# EasyEDA Pro project ProPrj_ESP32精英板_2025-06-25.epro

# Schematic Schematic1

## Sheets
1 Core: Board Name: Board1; Create Date: 2023-09-26; Page Name: Core; Project Name: ESP32精英板; Schematic Name: Schematic1; Update Date: 2025-05-17; Company: 嘉立创EDA; Page Size: A4; Version: V1.0
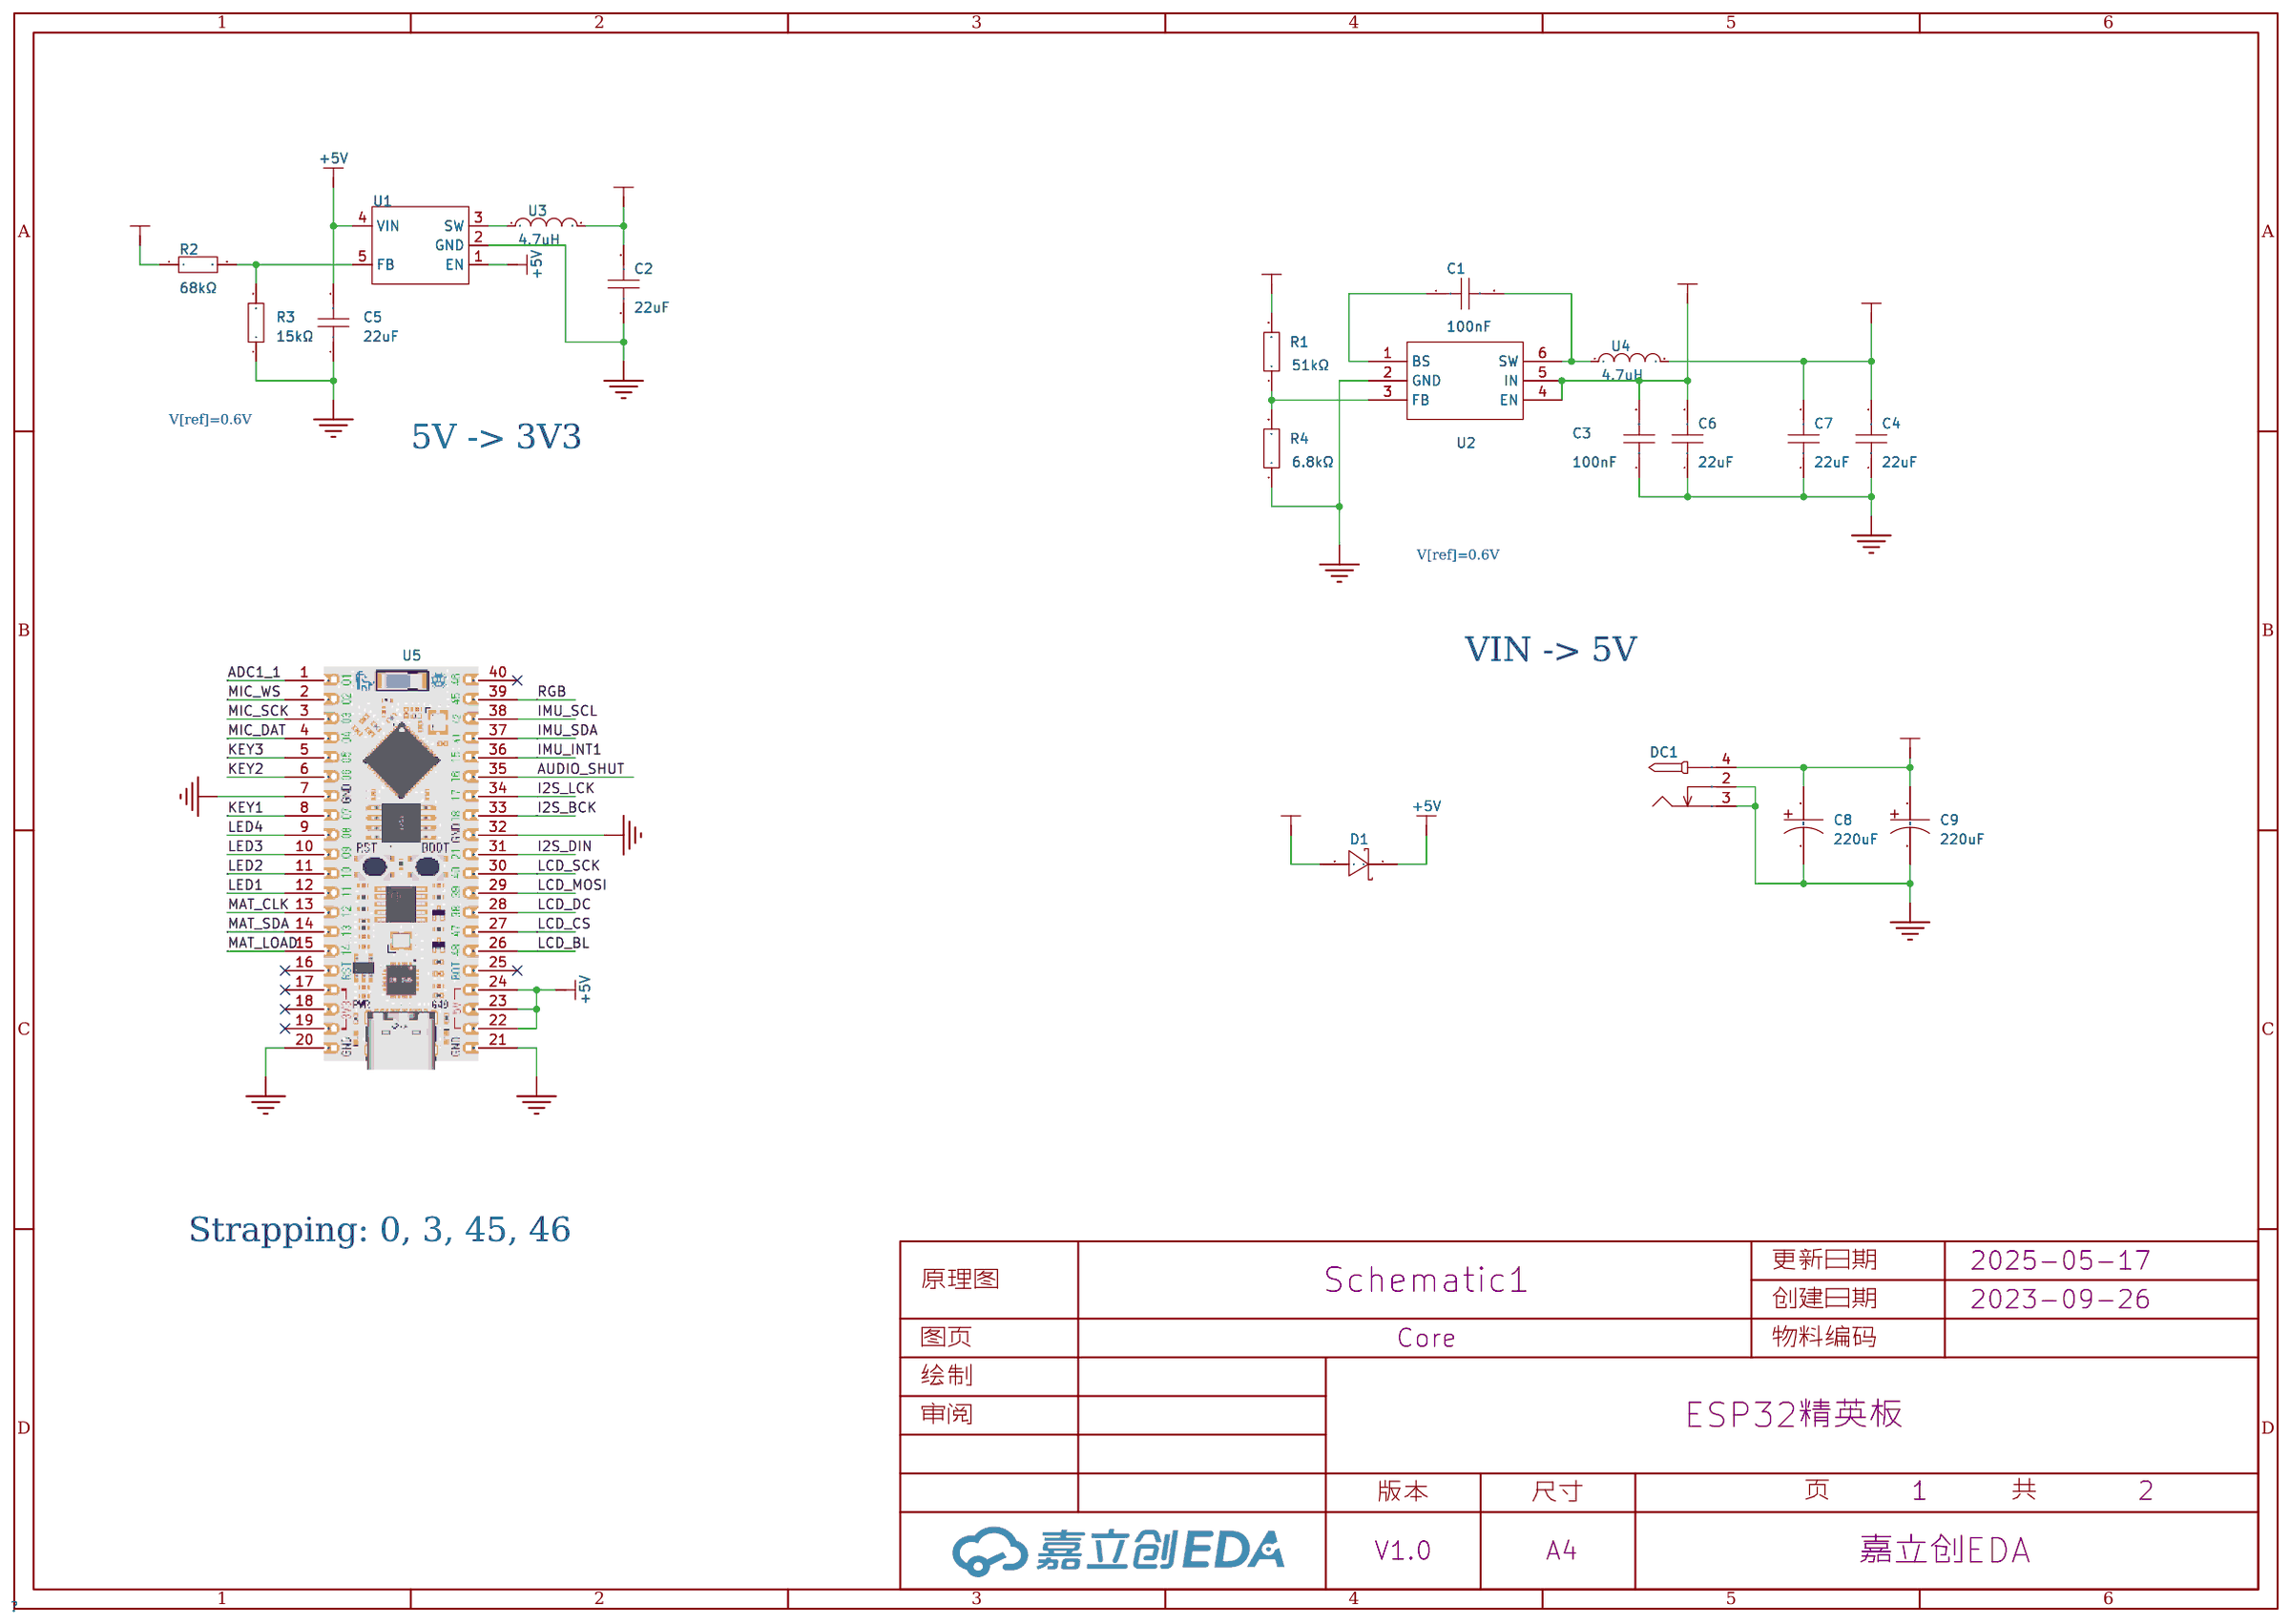
[diagram p0: Core]
2 Peripheral: Page Name: Peripheral; Update Date: 2025-05-12
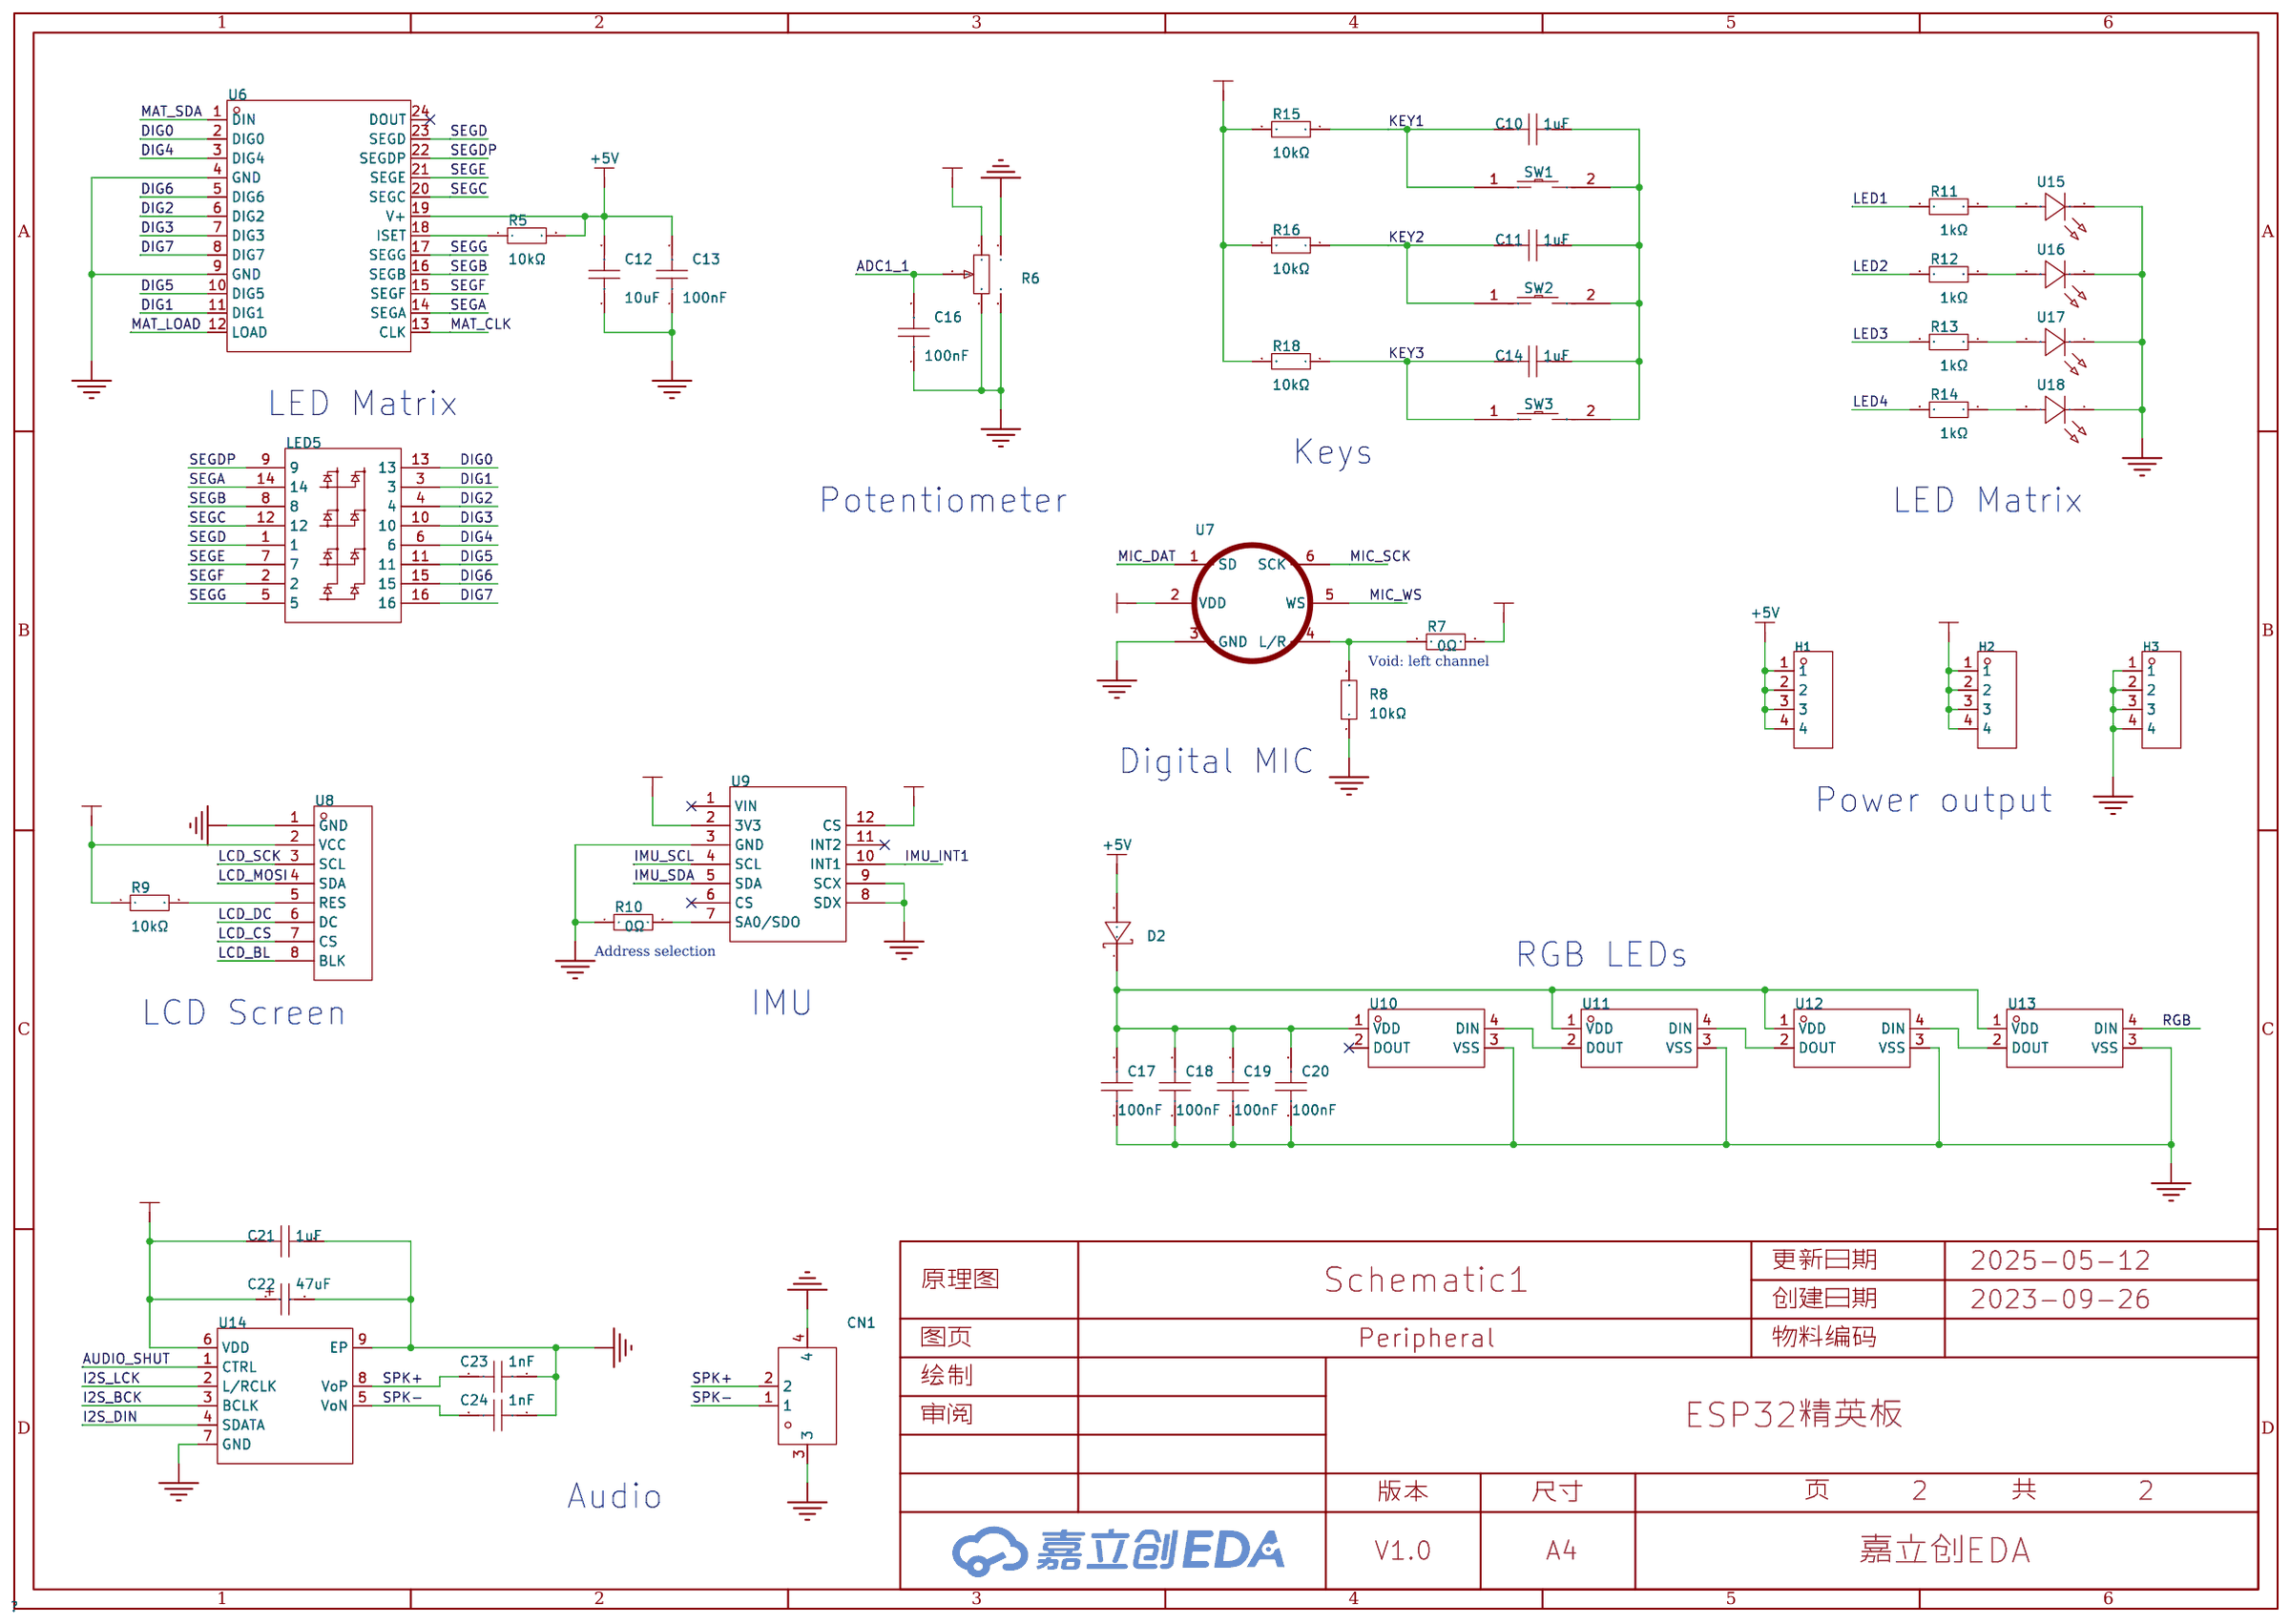
[diagram p1: Peripheral]

## Parts
sheet Core
C1  100nF  [c1206-nsk]
C2  22uF  [c1206-nsk]
C3  100nF  [c1206-nsk]
C4  22uF  [c1206-nsk]
C5  22uF  [c1206-nsk]
C6  22uF  [c1206-nsk]
C7  22uF  [c1206-nsk]
C8  220uF  [CAP-SMD_BD8.0-L8.3-W8.3-FD]
C9  220uF  [CAP-SMD_BD8.0-L8.3-W8.3-FD]
D1  SS34  [SMA_L4.3-W2.6-LS5.2-RD]
DC1  -  [DC-2.0]
R1  51kΩ  [R1206-NSK]
R2  68kΩ  [R1206-NSK]
R3  15kΩ  [R1206-NSK]
R4  6.8kΩ  [R1206-NSK]
U1  MT3520B  [SOT-23-5_L3.0-W1.7-P0.95-LS2.8-BR]
U2  MT2492  [SOT-23-6_L2.9-W1.6-P0.95-LS2.8-BL]
U3  4.7uH  [IND-SMD_L4.4-W4.2]
U4  4.7uH  [IND-SMD_L4.4-W4.2]
U5  LCKFB-ESP32S3R8N8  [DIP-40_L20.32-W51.66-P2.54-LS15.24]
sheet Peripheral
C10  1uF  [c1206-nsk]
C11  1uF  [c1206-nsk]
C12  10uF  [c1206-nsk]
C13  100nF  [c1206-nsk]
C14  1uF  [c1206-nsk]
C16  100nF  [c1206-nsk]
C17  100nF  [c1206-nsk]
C18  100nF  [c1206-nsk]
C19  100nF  [c1206-nsk]
C20  100nF  [c1206-nsk]
C21  1uF  [c1206-nsk]
C22  47uF  [CAP-SMD_L3.2-W1.6-RD]
C23  1nF  [c1206-nsk]
C24  1nF  [c1206-nsk]
CN1  HC-1.25-2PWT  [CONN-SMD_2P-P1.25-HC-1.25-2PWT]
D2  SS14  [SMA_L4.2-W2.6-LS5.3-RD]
H1  -  [HDR-TH_4P-P2.54-V-M]
H2  -  [HDR-TH_4P-P2.54-V-M]
H3  -  [HDR-TH_4P-P2.54-V-M]
LED5  SLD1388DRA1GD  [LED-TH_SLD1388DRA1GD]
R5  10kΩ  [R1206-NSK]
R6  RV09AF-40-15K-B10K-0C  [RES-ADJ-TH_RV09]
R7  0Ω  [R1206-NSK]
R8  10kΩ  [R1206-NSK]
R9  10kΩ  [R1206-NSK]
R10  0Ω  [R1206-NSK]
R11  1kΩ  [R1206-NSK]
R12  1kΩ  [R1206-NSK]
R13  1kΩ  [R1206-NSK]
R14  1kΩ  [R1206-NSK]
R15  10kΩ  [R1206-NSK]
R16  10kΩ  [R1206-NSK]
R18  10kΩ  [R1206-NSK]
SW1  GT-TC057A-H043-L1  [SW-SMD_L6.0-W3.5-LS8.2]
SW2  GT-TC057A-H043-L1  [SW-SMD_L6.0-W3.5-LS8.2]
SW3  GT-TC057A-H043-L1  [SW-SMD_L6.0-W3.5-LS8.2]
U6  HT7219ARWZ  [SOIC-24_L15.4-W7.5-P1.27-LS10.3-TL]
U7  -  [INMP441_6P]
U8  TFT模块接口  [HDR-TH_8P-P2.54-V-M]
U9  -  [GY-LSM6DS3]
U10  WS2812B  [LED-SMD_4P-L5.0-W5.0-TL]
U11  WS2812B  [LED-SMD_4P-L5.0-W5.0-TL]
U12  WS2812B  [LED-SMD_4P-L5.0-W5.0-TL]
U13  WS2812B  [LED-SMD_4P-L5.0-W5.0-TL]
U14  NS4168  [ESOP-8_L4.9-W3.9-P1.27-LS6.0-BL-EP-1]
U15  LED1206  [LED1206-RD]
U16  LED1206  [LED1206-RD]
U17  LED1206  [LED1206-RD]
U18  LED1206  [LED1206-RD]

## Library data of the parts
C1 C3 C13 C16-C20 = CL31B104KBCNNNC: 容值:100nF;精度:±10%;额定电压:50V;材质(温度系数):X7R;; LCSC Part Name: 100nF ±10% 50V; Supplier Part: C24497; Manufacturer: SAMSUNG(三星); Supplier Footprint: 1206; JLCPCB Part Class: Basic Part; Datasheet: https://atta.szlcsc.com/upload/public/pdf/source/20160218/1457707763339.pdf; Supplier: LCSC; Tolerance: ±10%; Voltage Rated: 50V; Temperature Coefficient: X7R
C2 C4-C7 = HGC1206R5226M250NSPJ: 容值:22uF;精度:±20%;额定电压:25V;温度系数:X5R;; LCSC Part Name: 22uF ±20% 25V; Supplier Part: C7432786; Manufacturer: Chinocera(华瓷); Supplier Footprint: 1206; JLCPCB Part Class: Extended Part; Datasheet: https://atta.szlcsc.com/upload/public/pdf/source/20240320/FAC3FEC40A78BC5CCCE96C232A94D860.pdf; Supplier: LCSC; Tolerance: ±20%; Voltage Rating: 25V; Temperature Coefficient: X5R
C8 C9 = VT1E221M0810: 容值:220uF;精度:±20%;额定电压:25V;纹波电流:183mA@120Hz;等效串联电阻(ESR):-;; LCSC Part Name: 220uF ±20% 25V; Supplier Part: C191825; Manufacturer: ROQANG(容强); Supplier Footprint: SMD,D8xL10.2mm; Datasheet: https://atta.szlcsc.com/upload/public/pdf/source/20180502/C191859_5B846418F1FC4C14CCCE0409874E2ED6.pdf; Supplier: LCSC; Tolerance: ±20%; Voltage Rating: 25V; Ripple Current: 183mA@120Hz; Diameter: 8mm; Height - Seated (Max): 10.2mm; Lifetime: 2000hrs@105℃; Operating Temperature: -40℃~+105℃
D1 = SS34_C8678: 二极管配置:独立式;直流反向耐压(Vr):40V;平均整流电流(Io):3A;正向压降(Vf):550mV@3A;; LCSC Part Name: 40V 3A 550mV@3A; Supplier Part: C8678; Manufacturer: MDD; Supplier Footprint: SMA(DO-214AC); JLCPCB Part Class: 基础库; Datasheet: https://atta.szlcsc.com/upload/public/pdf/source/20230314/A80AE34493C69B89E2F4B1712F433538.pdf; Supplier: LCSC; Diode Configuration: 独立式; Reverse Voltage (Vr): 40V; Average Rectified Current (Io): 3A; Forward Voltage (Vf@If): 550mV@3A; Reverse Leakage Current (Ir): 500uA@40V
DC1 = DC-005_2.0: Supplier Footprint: 插件; Check: false
R1 = 1206W4F5102T5E: 电阻类型:厚膜电阻;阻值:51kΩ;精度:±1%;功率:250mW;最大工作电压:200V;温度系数:±100ppm/℃;; LCSC Part Name: 51kΩ ±1% 250mW 厚膜电阻; Supplier Part: C17992; Manufacturer: UNI-ROYAL(厚声); Supplier Footprint: 1206; JLCPCB Part Class: Extended Part; Datasheet: https://atta.szlcsc.com/upload/public/pdf/source/20200306/C422600_1E6D84923E4A46A82E41ADD87F860B5C.pdf; Supplier: LCSC; Type: 厚膜电阻; Tolerance: ±1%; Power(Watts): 250mW; Overload Voltage (Max): 200V; Temperature Coefficient: ±100ppm/℃; Operating Temperature Range: -55℃~+155℃
R2 = 1206W4F6802T5E: 电阻类型:厚膜电阻;阻值:68kΩ;精度:±1%;功率:250mW;最大工作电压:200V;温度系数:±100ppm/℃;; LCSC Part Name: 68kΩ ±1% 250mW 厚膜电阻; Supplier Part: C25834; Manufacturer: UNI-ROYAL(厚声); Supplier Footprint: 1206; JLCPCB Part Class: Extended Part; Datasheet: https://atta.szlcsc.com/upload/public/pdf/source/20200306/C422600_1E6D84923E4A46A82E41ADD87F860B5C.pdf; Supplier: LCSC; Type: 厚膜电阻; Tolerance: ±1%; Power(Watts): 250mW; Overload Voltage (Max): 200V; Temperature Coefficient: ±100ppm/℃; Operating Temperature Range: -55℃~+155℃
R3 = RS-06K153JT: 电阻类型:厚膜电阻;阻值:15kΩ;精度:±5%;功率:250mW;最大工作电压:200V;温度系数:±100ppm/℃;; LCSC Part Name: 15kΩ ±5% 250mW; Supplier Part: C286642; Manufacturer: FH(风华); Supplier Footprint: 1206; JLCPCB Part Class: Extended Part; Datasheet: https://atta.szlcsc.com/upload/public/pdf/source/20140616/1457707091974.pdf; Supplier: LCSC; Type: 厚膜电阻; Tolerance: ±5%; Power(Watts): 250mW; Overload Voltage (Max): 200V; Temperature Coefficient: ±100ppm/℃; Operating Temperature Range: -55℃~+155℃
R4 = 1206W4F6801T5E: 电阻类型:厚膜电阻;阻值:6.8kΩ;精度:±1%;功率:250mW;最大工作电压:200V;温度系数:±100ppm/℃;; LCSC Part Name: 6.8kΩ ±1% 250mW 厚膜电阻; Supplier Part: C26034; Manufacturer: UNI-ROYAL(厚声); Supplier Footprint: 1206; JLCPCB Part Class: Extended Part; Datasheet: https://atta.szlcsc.com/upload/public/pdf/source/20200306/C422600_1E6D84923E4A46A82E41ADD87F860B5C.pdf; Supplier: LCSC; Type: 厚膜电阻; Tolerance: ±1%; Power(Watts): 250mW; Overload Voltage (Max): 200V; Temperature Coefficient: ±100ppm/℃; Operating Temperature Range: -55℃~+155℃
U1 = MT3520B: 功能类型:降压型;工作电压:2.3V~6V;输出电流:2A;; LCSC Part Name: 停产 MT3520B; Supplier Part: C2684933; Manufacturer: 西安航天民芯; Supplier Footprint: SOT-23-5; JLCPCB Part Class: 扩展库; Datasheet: https://atta.szlcsc.com/upload/public/pdf/source/20210114/C2684933_96E48358A8EFBD651AA46655486A36EF.pdf; Supplier: LCSC; Function: 降压型; Voltage - Supply: 2.3V~6V; Output Current: 2A; Frequency - Switching: 1.5MHz; Operating Temperature: -40℃~+85℃; Synchronous Rectifier: 是; Number of Outputs: 1; Switch tube (built-in/external): 内置
U2 = MT2492: 功能类型:降压型;同步整流:-;输出通道数:-;拓扑结构:-;输入电压:-;输出电流(最大值):-;开关频率:-;; LCSC Part Name: 降压型; Supplier Part: C89358; Manufacturer: 西安航天民芯; Supplier Footprint: SOT-23-6; JLCPCB Part Class: 扩展库; Datasheet: https://atta.szlcsc.com/upload/public/pdf/source/20221209/5C81DA9662873D3A116170FFBF63E49D.pdf; Supplier: LCSC; Function: 降压型
U3 U4 = APH0420T4R7M: 电感值:4.7uH;精度:±20%;额定电流:2.29A;饱和电流(Isat):2.49A;类型:一体成型电感;; LCSC Part Name: 4.7uH ±20% 2.49A; Supplier Part: C5349668; Manufacturer: APV(爱普微); Supplier Footprint: SMD,4.4x4.2mm; JLCPCB Part Class: 扩展库; Datasheet: https://atta.szlcsc.com/upload/public/pdf/source/20240422/44C6AF90C0CE08E50D7C2708B16BB974.pdf; Supplier: LCSC; Tolerance: ±20%; Rated Current: 2.29A; Saturation Current (Isat): 2.49A; DC Resistance (DCR): 105mΩ; Type: 一体成型电感
U5 = LCKFB-ESP32S3R8N8: LCSC Part Name: 立创·ESP32S3R8N8 开发板; Supplier Part: C20626143; Manufacturer: 立创开发板; JLCPCB Part Class: Extended Part; Datasheet: https://atta.szlcsc.com/upload/public/pdf/source/20241206/8BAF30E9665AF2DA28B66306BACEE9A0.pdf; Supplier: LCSC
C10 C11 C14 C21 = CL31B105KBHNNNE: 容值:1uF;精度:±10%;额定电压:50V;材质(温度系数):X7R;; LCSC Part Name: 1uF ±10% 50V; Supplier Part: C1848; Manufacturer: SAMSUNG(三星); Supplier Footprint: 1206; JLCPCB Part Class: Basic Part; Datasheet: https://atta.szlcsc.com/upload/public/pdf/source/20160218/1457707763339.pdf; Supplier: LCSC; Tolerance: ±10%; Voltage Rated: 50V; Temperature Coefficient: X7R
C12 = HGC1206R5106K500NSPJ: 容值:10uF;精度:±10%;额定电压:50V;温度系数:X5R;; LCSC Part Name: 10uF ±10% 50V; Supplier Part: C7432781; Manufacturer: Chinocera(华瓷); Supplier Footprint: 1206; JLCPCB Part Class: Extended Part; Datasheet: https://atta.szlcsc.com/upload/public/pdf/source/20240320/FAC3FEC40A78BC5CCCE96C232A94D860.pdf; Supplier: LCSC; Tolerance: ±10%; Voltage Rating: 50V; Temperature Coefficient: X5R
C22 = TAJA476K006RNJ: 容值:47uF;精度:±10%;额定电压:6.3V;等效串联电阻:1.6Ω@100kHz;; LCSC Part Name: 47uF ±10% 6.3V; Supplier Part: C7190; Manufacturer: Kyocera AVX; Supplier Footprint: CASE-A-3216; JLCPCB Part Class: Extended Part; Datasheet: https://atta.szlcsc.com/upload/public/pdf/source/20160107/1457707748639.pdf; Supplier: LCSC; Tolerance: ±10%; Rated Voltage: 6.3V; Equivalent Series Resistance(ESR): 1.6Ω@100kHz; Operating Temperature: -55℃~+125℃
C23 C24 = 1206B102K202NT: 容值:1nF;精度:±10%;额定电压:2kV;温度系数:X7R;; LCSC Part Name: 1nF ±10% 2kV; Supplier Part: C9196; Manufacturer: FH(风华); Supplier Footprint: 1206; JLCPCB Part Class: Basic Part; Datasheet: https://atta.szlcsc.com/upload/public/pdf/source/20200305/C486355_26A10D38EF8C2A5C37091D0039909270.pdf; Supplier: LCSC; Tolerance: ±10%; Voltage Rating: 2kV; Temperature Coefficient: X7R
CN1 = HC-1.25-2PWT: 插针结构:1x2P;间距:1.25mm;安装方式:卧贴;参考系列:PicoBlade(MX 1.25);总PIN数:2P;排数:1;每排PIN数:2;行距:-;额定电流:1A;触头材质:黄铜;触头镀层:锡;工作温度范围:-40℃~+105℃;; LCSC Part Name: 1x2P 间距:1.25mm 卧贴 系列:PicoBlade(MX 1.25); Supplier Part: C2845379; Manufacturer: HCTL(华灿天禄); Supplier Footprint: SMD,P=1.25mm,卧贴; JLCPCB Part Class: 扩展库; Datasheet: https://atta.szlcsc.com/upload/public/pdf/source/20240930/9508A8292CCC87B0C29E3A028D56E30A.pdf; Supplier: LCSC; Pins Structure: 1x2P; Pitch: 1.25mm; Mounting Style: 卧贴; Reference Series: PicoBlade(MX 1.25); Number of Pins: 2P; Number of Rows: 1; Number of PINs Per Row: 2; Current Rating (Max): 1A; Contact Material: 黄铜; Contact Plating: 锡; Operating Temperature Range: -40℃~+105℃; Rated Voltage (Max): 125V; Plastic Material: LCP; Flame Retardant Rating: UL94V-0; Supplementary Features: 辅助焊脚; Z-Height of the Board: 3.57mm; X-Length of Bottom Edge on Board (Spacing Line): 7.55mm; Y-Width of Bottom Edge on Board: 5.25mm
D2 = SS14_C2480: 二极管配置:独立式;正向压降(Vf):550mV@1A;直流反向耐压(Vr):40V;整流电流:1A;; LCSC Part Name: 电压:40V 电流:1A; Supplier Part: C2480; Manufacturer: MDD(辰达半导体); Supplier Footprint: SMA(DO-214AC); JLCPCB Part Class: 基础库; Datasheet: https://atta.szlcsc.com/upload/public/pdf/source/20240710/EF24798823EE33D63F154ED67BAC5E71.pdf; Supplier: LCSC; Diode Configuration: 独立式; Forward Voltage (Vf@If): 550mV@1A; Reverse Voltage (Vr): 40V; Rectified Current: 1A; Reverse Leakage Current (Ir): 300uA@40V
H1-H3 = HDR-M_2.54_1x4P: Supplier Part: C492403; Supplier Footprint: 插件
LED5 = SLD1388DRA1GD_C2913075: 位数:8x8;发光颜色:红色;极性:共阳;; LCSC Part Name: 8*8mm,红光,共阳LED点阵数码管,插件; Supplier Part: C2913075; Manufacturer: SUNLIGHT(光华); Supplier Footprint: 插件; JLCPCB Part Class: 扩展库; Datasheet: https://atta.szlcsc.com/upload/public/pdf/source/20180608/C225991_CE8A1D71268437AD8DFF1F8467A765B7.pdf; Supplier: LCSC; Dot Matrix Number: 8x8; Emitting Color: 红色; Polarity: 共阳
R5 R8 R9 R15 R16 R18 = 1206W4F1002T5E: 电阻类型:厚膜电阻;阻值:10kΩ;精度:±1%;功率:250mW;最大工作电压:200V;温度系数:±100ppm/℃;; LCSC Part Name: 10kΩ ±1% 250mW 厚膜电阻; Supplier Part: C17902; Manufacturer: UNI-ROYAL(厚声); Supplier Footprint: 1206; JLCPCB Part Class: Basic Part; Datasheet: https://atta.szlcsc.com/upload/public/pdf/source/20200306/C422600_1E6D84923E4A46A82E41ADD87F860B5C.pdf; Supplier: LCSC; Type: 厚膜电阻; Tolerance: ±1%; Power(Watts): 250mW; Overload Voltage (Max): 200V; Temperature Coefficient: ±100ppm/℃; Operating Temperature Range: -55℃~+155℃
R6 = RV09AF-40-15K-B10K-0C: Supplier Part: C5151446; Supplier Footprint: 插件; JLCPCB Part Class: 扩展库; Supplier: LCSC
R7 R10 = 1206W4F0000T5E: 电阻类型:厚膜电阻;阻值:0Ω;精度:±1%;功率:250mW;最大工作电压:200V;温度系数:±800ppm/℃;; LCSC Part Name: 0Ω ±1% 250mW 厚膜电阻; Supplier Part: C17888; Manufacturer: UNI-ROYAL(厚声); Supplier Footprint: 1206; JLCPCB Part Class: Basic Part; Datasheet: https://atta.szlcsc.com/upload/public/pdf/source/20200306/C422600_1E6D84923E4A46A82E41ADD87F860B5C.pdf; Supplier: LCSC; Type: 厚膜电阻; Tolerance: ±1%; Power(Watts): 250mW; Overload Voltage (Max): 200V; Temperature Coefficient: ±800ppm/℃; Operating Temperature Range: -55℃~+155℃
R11-R14 = 1206W4F1001T5E_C4410: 电阻类型:厚膜电阻;阻值:1kΩ;精度:±1%;功率:250mW;最大工作电压:200V;; LCSC Part Name: 1kΩ ±1% 250mW 厚膜电阻; Supplier Part: C4410; Manufacturer: UNI-ROYAL(厚声); Manufacturer Part: 1206W4F1001T5E; Supplier Footprint: 1206; JLCPCB Part Class: Basic Part; Datasheet: https://atta.szlcsc.com/upload/public/pdf/source/20200306/C422600_1E6D84923E4A46A82E41ADD87F860B5C.pdf; Supplier: LCSC; Type: 厚膜电阻; Tolerance: ±1%; Power(Watts): 250mW; Overload Voltage (Max): 200V; Operating Temperature Range: -55℃~+155℃
SW1-SW3 = GT-TC057A-H043-L1: 触点电流:50mA;额定电压(DC):12V;绝缘电阻:100MΩ;电路结构:单刀单掷;安装方式:立贴;带灯:无;作用力:160gf@±30gf;机械寿命:10万次;带支架:否;; LCSC Part Name: 6*3.5*4.3mm 立贴 轻触开关; Supplier Part: C843677; Manufacturer: G-Switch(品赞); Supplier Footprint: SMD; JLCPCB Part Class: Extended Part; Datasheet: https://atta.szlcsc.com/upload/public/pdf/source/20201110/C843677_DEB4979EF332B8E57B4292C014A2ED6A.pdf; Supplier: LCSC; Contact Current: 50mA; Voltage Rating (DC): 12V; Insulation Resistance: 100MΩ; Circuit: 单刀单掷; Mounting Style: 立贴; Actuator Style: 矩形按钮; Actuator/Cap Color: 黑色; With Lamp: 无; Operating Force: 160gf@±30gf; Mechanical Life: 10万次; Operating Temperature: -30℃~+85℃; Pin Style: 鸥翼型; Switch Length: 6mm; Switch Width: 3.5mm; Switch Height: 4.3mm; Strike Gundam: 否
U6 = HT7219ARWZ: 串行接口， 8位LED显示驱动器; Supplier Part: C2834487; Manufacturer: HTCSEMI(海天芯); Supplier Footprint: SOP-24; JLCPCB Part Class: 扩展库; Datasheet: https://atta.szlcsc.com/upload/public/pdf/source/20210730/C2834487_B6FE5CAFBF35974579B95809D10FECA5.pdf; Supplier: LCSC
U7 = INMP441: INMP441是一款高性能，低功耗，数字输出，带底部端口的全向MEMS麦克风; Check: false
U8 = TFT模块接口: Check: false
U9 = GY-LSM6DS3: Check: false
U10-U13 = WS2812B_C9900004137: Supplier Part: C9900004137; Supplier Footprint: LED-4_5050; JLCPCB Part Class: 扩展库; Supplier: LCSC
U14 = NS4168: Supplier Part: C9900042517; Supplier Footprint: ESOP-8; Supplier: LCSC
U15-U18 = LED1206: Supplier Part: C9900027223; JLCPCB Part Class: 扩展库; Supplier: LCSC

## Nets
3V3: C2.2 C21.1 C22.1 H2.1 H2.2 H2.3 H2.4 R2.1 R6.1 R7.2 R9.1 R15.2 R16.2 R18.2 U3.2 U7.2(VDD) U8.2(VCC) U9.2(3V3) U9.12(CS) U14.6(VDD)
+5V: C5.2 C12.2 C13.2 D1.1(K) D2.2(A) H1.1 H1.2 H1.3 H1.4 R5.2 U1.1(EN) U1.4(VIN) U5.22(3V3) U5.23(3V3) U5.24(3V3) U6.19(V+)
+5V_BUCK: C4.2 C7.2 D1.2(A) R1.2 U4.2
GND: C2.1 C3.1 C4.1 C5.1 C6.1 C7.1 C8.2 C9.2 C10.1 C11.1 C12.1 C13.1 C14.1 C16.1 C17.1 C18.1 C19.1 C20.1 C21.2 C22.2 C23.1 C24.1 CN1.3 CN1.4 DC1.2 DC1.3 H3.1 H3.2 H3.3 H3.4 R3.1 R4.1 R6.3 R6.4 R6.5 R8.1 R10.1 SW1.2 SW2.2 SW3.2 U1.2(GND) U2.2(GND) U5.7(GND) U5.20(GND) U5.21(GND) U5.32(G08) U6.4(GND) U6.9(GND) U7.3(GND) U8.1(GND) U9.3(GND) U9.8(SDX) U9.9(SCX) U10.3(VSS) U11.3(VSS) U12.3(VSS) U13.3(VSS) U14.7(GND) U14.9(EP) U15.1(K) U16.1(K) U17.1(K) U18.1(K)
VIN: C3.2 C6.2 C8.1 C9.1 DC1.4 U2.4(EN) U2.5(IN)
ADC1_1: C16.2 R6.2 U5.1(G01)
AUDIO_SHUT: U5.35(G06) U14.1(CTRL)
DIG0: LED5.13 U6.2(DIG0)
DIG1: LED5.3 U6.11(DIG1)
DIG2: LED5.4 U6.6(DIG2)
DIG3: LED5.10 U6.7(DIG3)
DIG4: LED5.6 U6.3(DIG4)
DIG5: LED5.11 U6.10(DIG5)
DIG6: LED5.15 U6.5(DIG6)
DIG7: LED5.16 U6.8(DIG7)
I2S_BCK: U5.33(G07) U14.3(BCLK)
I2S_DIN: U5.31(G09) U14.4(SDATA)
I2S_LCK: U5.34(GND) U14.2(L/RCLK)
IMU_INT1: U5.36(G05) U9.10(INT1)
IMU_SCL: U5.38(G03) U9.4(SCL)
IMU_SDA: U5.37(G04) U9.5(SDA)
KEY1: C10.2 R15.1 SW1.1 U5.8(G07)
KEY2: C11.2 R16.1 SW2.1 U5.6(G06)
KEY3: C14.2 R18.1 SW3.1 U5.5(G05)
LCD_BL: U5.26(G14) U8.8(BLK)
LCD_CS: U5.27(G13) U8.7(CS)
LCD_DC: U5.28(G12) U8.6(DC)
LCD_MOSI: U5.29(G11) U8.4(SDA)
LCD_SCK: U5.30(G10) U8.3(SCL)
LED1: R11.2 U5.12(G11)
LED2: R12.2 U5.11(G10)
LED3: R13.2 U5.10(G09)
LED4: R14.2 U5.9(G08)
MAT_CLK: U5.13(G12) U6.13(CLK)
MAT_LOAD: U5.15(G14) U6.12(LOAD)
MAT_SDA: U5.14(G13) U6.1(DIN)
MIC_DAT: U5.4(G04) U7.1(SD)
MIC_SCK: U5.3(G03) U7.6(SCK)
MIC_WS: U5.2(G02) U7.5(WS)
RGB: U5.39(G02) U13.4(DIN)
SEGA: LED5.14 U6.14(SEGA)
SEGB: LED5.8 U6.16(SEGB)
SEGC: LED5.12 U6.20(SEGC)
SEGD: LED5.1 U6.23(SEGD)
SEGDP: LED5.9 U6.22(SEGDP)
SEGE: LED5.7 U6.21(SEGE)
SEGF: LED5.2 U6.15(SEGF)
SEGG: LED5.5 U6.17(SEGG)
SPK+: C23.2 CN1.2 U14.8(VoP)
SPK-: C24.2 CN1.1 U14.5(VoN)
$1N3653: C1.2 U2.6(SW) U4.1
$1N3654: C1.1 U2.1(BS)
$1N3655: R1.1 R4.2 U2.3(FB)
$1N9647: R2.2 R3.2 U1.5(FB)
$1N9651: U1.3(SW) U3.1
$2N2035: U12.4(DIN) U13.2(DOUT)
$2N2040: U10.4(DIN) U11.2(DOUT)
$2N2043: U11.4(DIN) U12.2(DOUT)
$2N2181: C17.2 C18.2 C19.2 C20.2 D2.1(K) U10.1(VDD) U11.1(VDD) U12.1(VDD) U13.1(VDD)
$2N3036: R11.1 U15.2(A)
$2N3041: R12.1 U16.2(A)
$2N3046: R13.1 U17.2(A)
$2N3051: R14.1 U18.2(A)
$2N4680: R5.1 U6.18(ISET)
$2N12609: R9.2 U8.5(RES)
$2N13495: R10.2 U9.7(SA0/SDO)
$2N13842: R7.1 R8.2 U7.4(L/R)

Not connected (* = marked no-connect by the designer): U5 16(RST)* 17(3V3)* 18(3V3)* 19(3V3)* 25(RST)* 40(G01)*; U6 24(DOUT)*; U9 1(VIN)* 6(CS)* 11(INT2)*; U10 2(DOUT)*

## Notes on the sheets
sheet 1
- V[ref]=0.6V
- 5V -> 3V3
- V[ref]=0.6V
- VIN -> 5V
- Strapping: 0, 3, 45, 46
sheet 2
- LED Matrix
- Keys
- Potentiometer
- LED Matrix
- Void: left channel
- Digital MIC
- Power output
- Address selection
- RGB LEDs
- LCD Screen
- IMU
- Audio

# Board PCB1
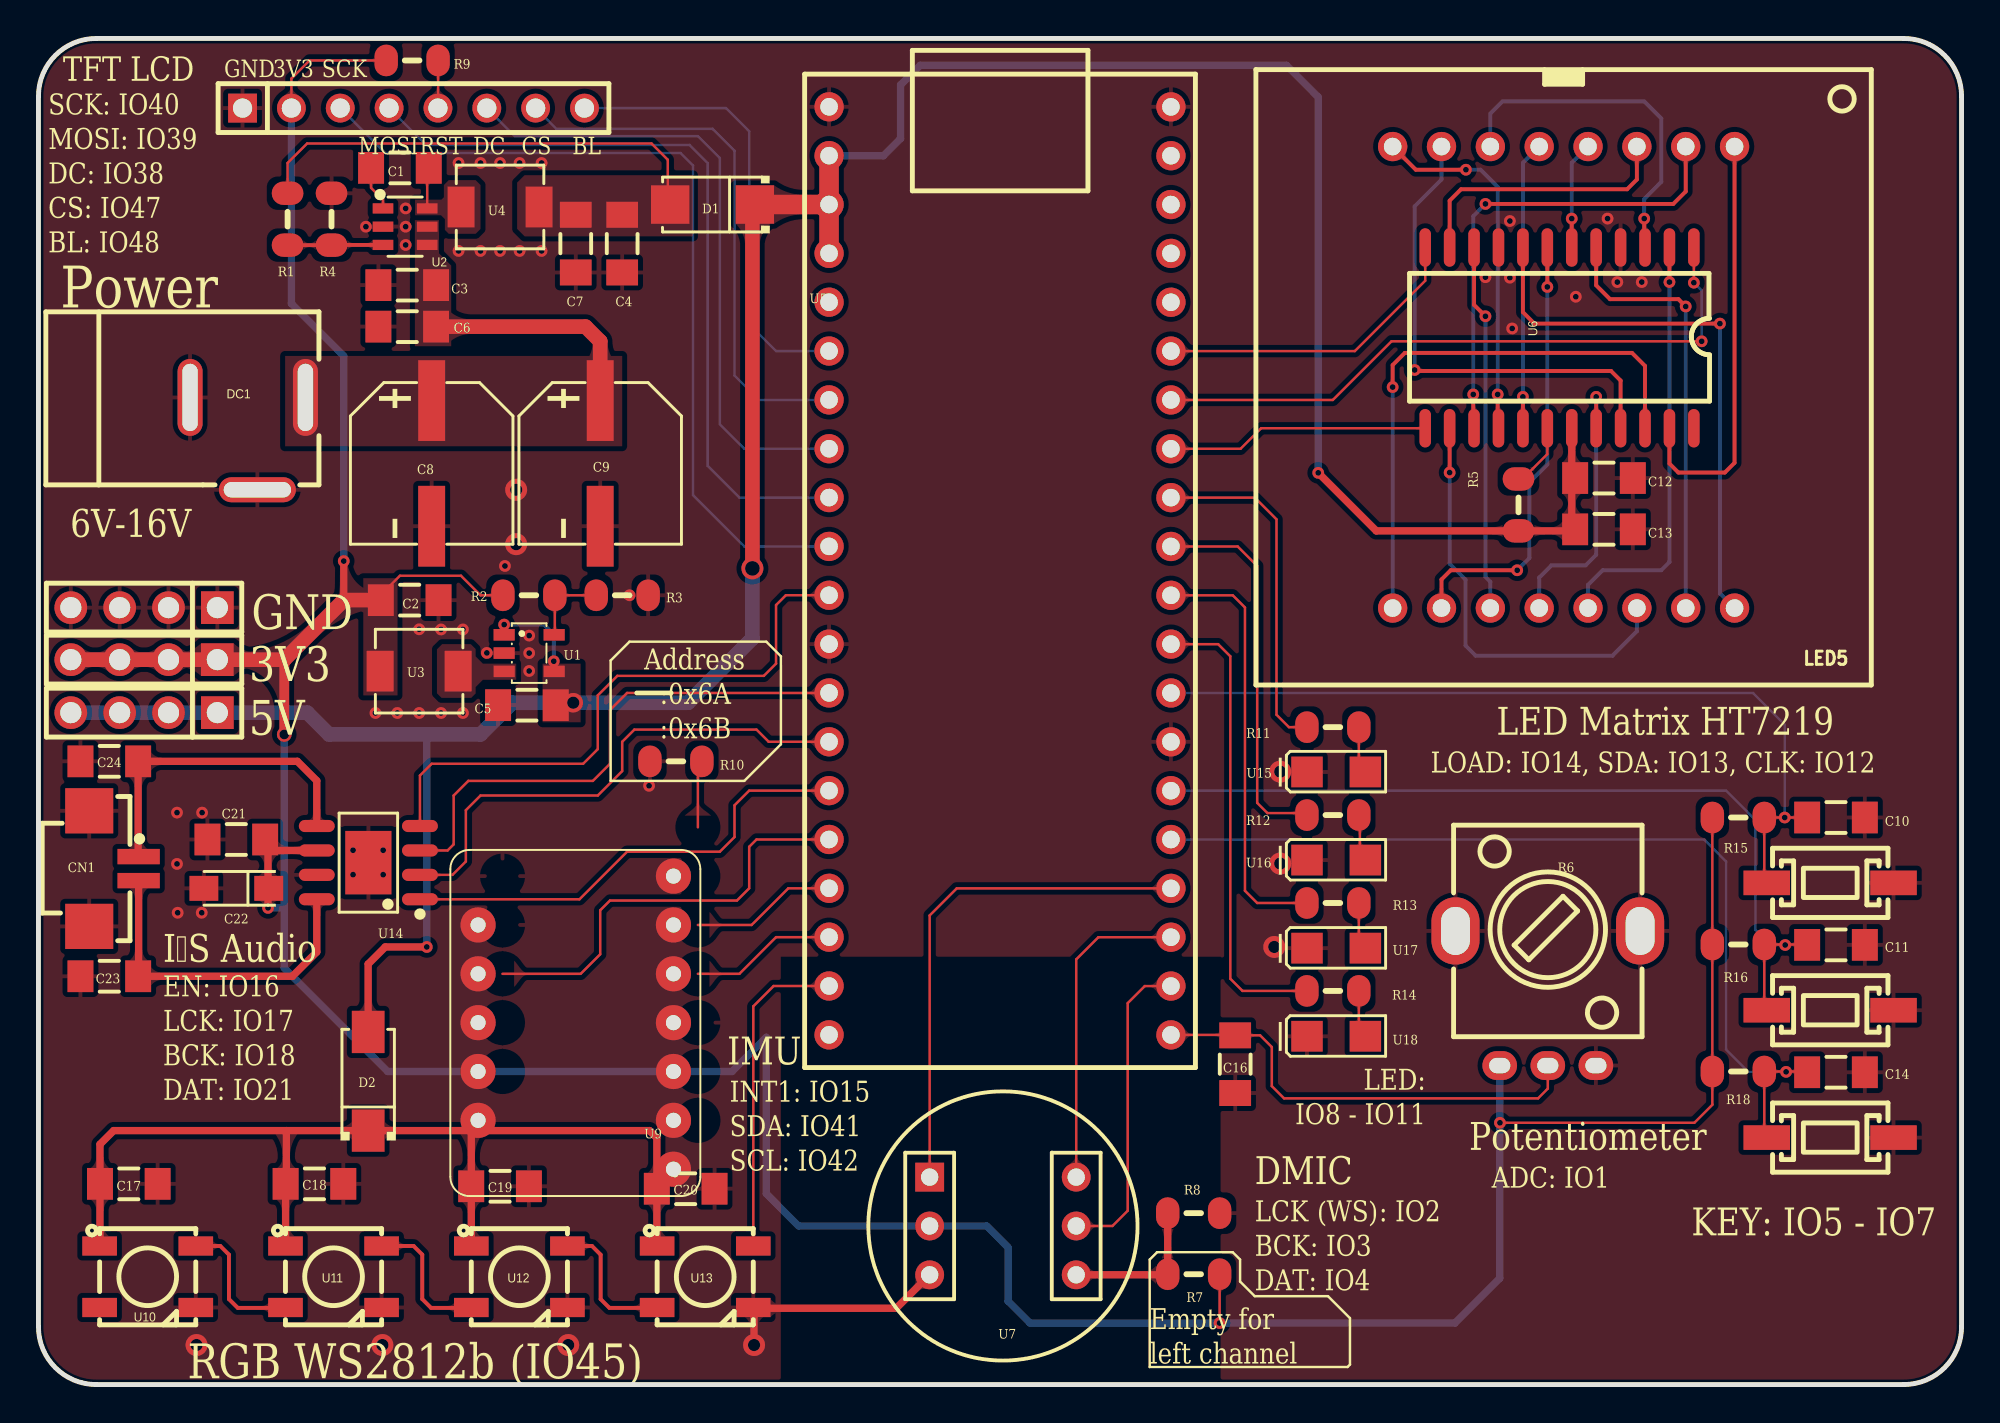
[diagram p2: board, top side]
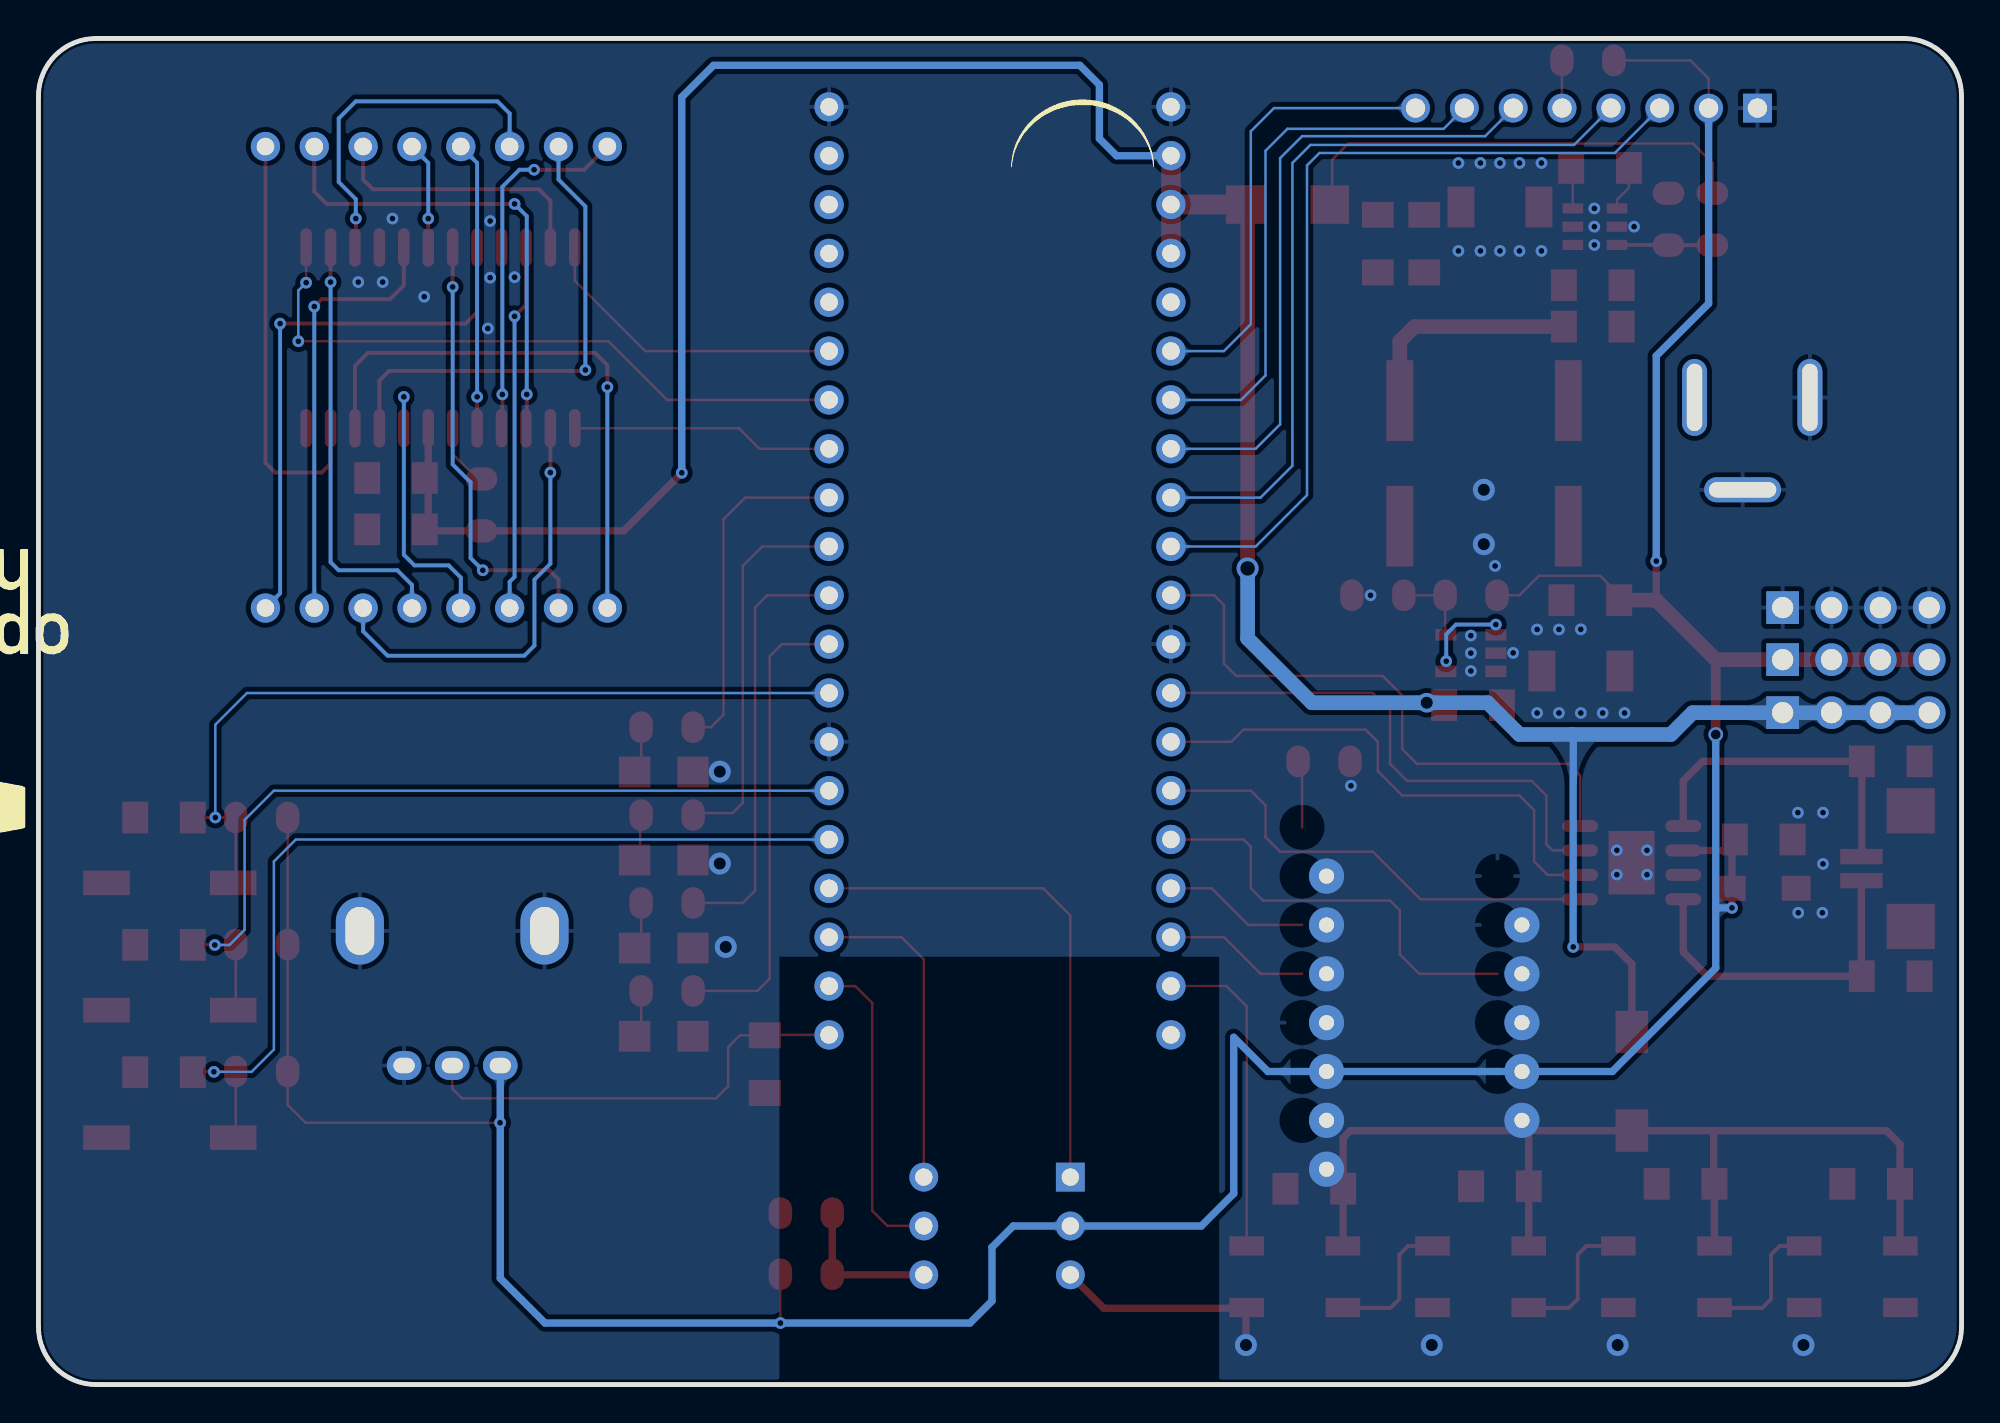
[diagram p3: board, bottom side, seen from below]

Outline 100 x 70 mm; copper layers: Top Layer, Bottom Layer. Coordinates in mm from the lower left corner of the outline.
Outline path: 0,67 0,3 arc(0.88,0.88) 3,0 97,0 arc(99.12,0.88) 100,3 100,67 arc(99.12,69.12) 97,70 3,70 arc(0.88,69.12) 0,67
Stack: Top Layer 0.035mm / Dielectric1 1.51mm FR4 er 4.5 / Bottom Layer 0.035mm

## Design rules (mm)
template: 自定义配置
spacing copperThickness1oz (default): track to track 0.102, other pairs 0.152 to 0.3
spacing copperThickness2oz: track to track 0.203, other pairs 0.152 to 0.3
track width copperThickness1oz (default): min 0.127, default 0.254, max 2.54
track width copperThickness2oz: min 0.203, default 0.254, max 2.54
differential pair differentialPair (default): width min 0.127, default 0.254, max 2.54; gap min 0.152, default 0.152
via viaSize (default): diameter min 0.5, default 0.61, max 10; hole min 0.3, default 0.305, max 6.3

## Placement (name value [footprint] x y rotation side)
C1  100nF  [c1206-nsk]  18.8 63.27 0 top
C2  22uF  [c1206-nsk]  19.3 40.79 180 top
C3  100nF  [c1206-nsk]  19.18 57.17 0 top
C4  22uF  [c1206-nsk]  30.35 59.33 90 top
C5  22uF  [c1206-nsk]  25.4 35.33 0 top
C6  22uF  [c1206-nsk]  19.18 55.01 0 top
C7  22uF  [c1206-nsk]  27.94 59.33 90 top
C8  220uF  [CAP-SMD_BD8.0-L8.3-W8.3-FD]  20.45 47.9 270 top
C9  220uF  [CAP-SMD_BD8.0-L8.3-W8.3-FD]  29.21 47.9 270 top
C10  1uF  [c1206-nsk]  93.47 29.49 180 top
C11  1uF  [c1206-nsk]  93.47 22.86 180 top
C12  10uF  [c1206-nsk]  81.41 47.14 180 top
C13  100nF  [c1206-nsk]  81.41 44.47 180 top
C14  1uF  [c1206-nsk]  93.47 16.24 180 top
C16  100nF  [c1206-nsk]  62.23 16.66 90 top
C17  100nF  [c1206-nsk]  4.7 10.44 180 top
C18  100nF  [c1206-nsk]  14.35 10.44 180 top
C19  100nF  [c1206-nsk]  24 10.31 180 top
C20  100nF  [c1206-nsk]  33.66 10.18 180 top
C21  1uF  [c1206-nsk]  10.29 28.34 180 top
C22  47uF  [CAP-SMD_L3.2-W1.6-RD]  10.29 25.8 180 top
C23  1nF  [c1206-nsk]  3.68 21.23 0 top
C24  1nF  [c1206-nsk]  3.68 32.41 0 top
CN1  HC-1.25-2PWT  [CONN-SMD_2P-P1.25-HC-1.25-2PWT]  3.92 26.83 270 top
D1  SS34  [SMA_L4.3-W2.6-LS5.2-RD]  35.05 61.36 180 top
D2  SS14  [SMA_L4.2-W2.6-LS5.3-RD]  17.14 15.77 90 top
DC1  -  [DC-2.0]  10.76 51.6 180 top
H1  -  [HDR-TH_4P-P2.54-V-M]  5.49 34.94 180 top
H2  -  [HDR-TH_4P-P2.54-V-M]  5.49 37.7 180 top
H3  -  [HDR-TH_4P-P2.54-V-M]  5.49 40.4 180 top
LED5  SLD1388DRA1GD  [LED-TH_SLD1388DRA1GD]  79.31 52.38 180 top
R1  51kΩ  [R1206-NSK]  12.95 60.6 90 top
R2  68kΩ  [R1206-NSK]  25.5 41.04 0 top
R3  15kΩ  [R1206-NSK]  30.35 41.04 180 top
R4  6.8kΩ  [R1206-NSK]  15.24 60.6 270 top
R5  10kΩ  [R1206-NSK]  76.96 45.74 270 top
R6  RV09AF-40-15K-B10K-0C  [RES-ADJ-TH_RV09]  78.49 20.09 0 top
R7  0Ω  [R1206-NSK]  60.07 5.74 0 top
R8  10kΩ  [R1206-NSK]  60.07 8.91 180 top
R9  10kΩ  [R1206-NSK]  19.43 68.86 0 top
R10  0Ω  [R1206-NSK]  33.15 32.41 0 top
R11  1kΩ  [R1206-NSK]  67.31 34.19 180 top
R12  1kΩ  [R1206-NSK]  67.31 29.61 180 top
R13  1kΩ  [R1206-NSK]  67.31 25.04 180 top
R14  1kΩ  [R1206-NSK]  67.31 20.47 180 top
R15  10kΩ  [R1206-NSK]  88.39 29.49 180 top
R16  10kΩ  [R1206-NSK]  88.39 22.88 180 top
R18  10kΩ  [R1206-NSK]  88.39 16.28 180 top
SW1  GT-TC057A-H043-L1  [SW-SMD_L6.0-W3.5-LS8.2]  93.17 26.09 0 top
SW2  GT-TC057A-H043-L1  [SW-SMD_L6.0-W3.5-LS8.2]  93.17 19.47 0 top
SW3  GT-TC057A-H043-L1  [SW-SMD_L6.0-W3.5-LS8.2]  93.17 12.84 0 top
U1  MT3520B  [SOT-23-5_L3.0-W1.7-P0.95-LS2.8-BR]  25.52 38.04 180 top
U2  MT2492  [SOT-23-6_L2.9-W1.6-P0.95-LS2.8-BL]  19.06 60.21 270 top
U3  4.7uH  [IND-SMD_L4.4-W4.2]  19.8 37.1 0 top
U4  4.7uH  [IND-SMD_L4.4-W4.2]  24 61.24 180 top
U5  LCKFB-ESP32S3R8N8  [DIP-40_L20.32-W51.66-P2.54-LS15.24]  50 42.31 180 top
U6  HT7219ARWZ  [SOIC-24_L15.4-W7.5-P1.27-LS10.3-TL]  79.1 54.43 270 top
U7  -  [INMP441_6P]  50.15 8.25 270 top
U8  TFT模块接口  [HDR-TH_8P-P2.54-V-M]  19.5 66.38 0 top
U9  -  [GY-LSM6DS3]  29.21 21.36 180 top
U10  WS2812B  [LED-SMD_4P-L5.0-W5.0-TL]  5.68 5.61 0 top
U11  WS2812B  [LED-SMD_4P-L5.0-W5.0-TL]  15.34 5.61 0 top
U12  WS2812B  [LED-SMD_4P-L5.0-W5.0-TL]  25.01 5.61 0 top
U13  WS2812B  [LED-SMD_4P-L5.0-W5.0-TL]  34.67 5.61 0 top
U14  NS4168  [ESOP-8_L4.9-W3.9-P1.27-LS6.0-BL-EP-1]  17.16 27.14 90 top
U15  LED1206  [LED1206-RD]  67.48 31.86 0 top
U16  LED1206  [LED1206-RD]  67.48 27.27 0 top
U17  LED1206  [LED1206-RD]  67.48 22.69 0 top
U18  LED1206  [LED1206-RD]  67.48 18.11 0 top

## Footprints (pads in the part's own frame, mm; a bottom-side part is the same pattern mirrored in y, then rotated)
c1206-nsk
  rect 1.35x1.65 smd: 1(-1.5,0) 2(1.5,0)
CAP-SMD_BD8.0-L8.3-W8.3-FD
  rect 4.2x1.4 smd: 1(-3.267,0) 2(3.267,0)
CAP-SMD_L3.2-W1.6-RD
  rect 1.5x1.296 smd: 1(-1.687,0) 2(1.687,0)
CONN-SMD_2P-P1.25-HC-1.25-2PWT
  rect 0.8x2.2 smd: 1(-0.625,1.285) 2(0.625,1.285)
  rect 2.35x2.5 smd: 3(-3.005,-1.285) 4(3.005,-1.285)
DC-2.0
  oval 4x1.3 hole 3.5x0.8: 2(-0.627,5.067)
  oval 1.3x4 hole 0.8x3.5: 3(2.873,0.267) 4(-3.127,0.267)
DIP-40_L20.32-W51.66-P2.54-LS15.24
  round 1.524 hole 0.914: 1(-8.889,24.131) 2(-8.889,21.591) 3(-8.889,19.052) 4(-8.889,16.512) 5(-8.889,13.972) 6(-8.889,11.431) 7(-8.889,8.892) 8(-8.889,6.351) 9(-8.889,3.812) 10(-8.889,1.272) 11(-8.889,-1.268) 12(-8.889,-3.808) 13(-8.889,-6.348) 14(-8.889,-8.889) 15(-8.889,-11.428) 16(-8.889,-13.969) 17(-8.889,-16.509) 18(-8.889,-19.049) 19(-8.889,-21.588) 20(-8.889,-24.128) 21(8.889,-24.131) 22(8.889,-21.591) 23(8.889,-19.052) 24(8.889,-16.512) 25(8.889,-13.972) 26(8.889,-11.431) 27(8.889,-8.892) 28(8.889,-6.351) 29(8.889,-3.812) 30(8.889,-1.272) 31(8.889,1.268) 32(8.889,3.808) 33(8.889,6.348) 34(8.889,8.889) 35(8.889,11.428) 36(8.889,13.969) 37(8.889,16.509) 38(8.889,19.049) 39(8.889,21.588) 40(8.889,24.128)
ESOP-8_L4.9-W3.9-P1.27-LS6.0-BL-EP-1
  oval 0.63x1.865 smd: 1(-1.905,-2.683) 2(-0.635,-2.683) 3(0.635,-2.683) 4(1.905,-2.683) 5(1.905,2.683) 6(0.635,2.683) 7(-0.635,2.683) 8(-1.905,2.683)
  rect 3.3x2.4 smd: 9(0,0)
GY-LSM6DS3
  round 1.827 hole 0.787: 1(-3.81,10.16) 2(-3.81,7.62) 3(-3.81,5.08) 4(-3.81,2.54) 5(-3.81,0) 6(-3.81,-2.54) 7(-3.81,-5.08) 8(6.35,-2.54) 9(6.35,0) 10(6.35,2.54) 11(6.35,5.08) 12(6.35,7.62)
HDR-TH_4P-P2.54-V-M
  rect 1.7x1.7 hole 1.1: 1(-3.81,0)
  round 1.7 hole 1.1: 2(-1.27,0) 3(1.27,0) 4(3.81,0)
HDR-TH_8P-P2.54-V-M
  rect 1.5x1.5 hole 1: 1(-8.89,0)
  round 1.5 hole 1: 2(-6.35,0) 3(-3.81,0) 4(-1.27,0) 5(1.27,0) 6(3.81,0) 7(6.35,0) 8(8.89,0)
IND-SMD_L4.4-W4.2
  rect 1.4x2.12 smd: 1(2.028,0) 2(-2.028,0)
INMP441_6P
  rect 1.5x1.5 hole 0.9: 1(-2.54,-3.81)
  round 1.5 hole 0.9: 2(0,-3.81) 3(2.54,-3.81) 4(2.54,3.81) 5(0,3.81) 6(-2.54,3.81)
LED1206-RD
  rect 1.635x1.6 smd: 1(-1.518,0) 2(1.518,0)
LED-SMD_4P-L5.0-W5.0-TL
  rect 1.8x1 smd: 1(-2.5,1.6) 2(-2.5,-1.6) 3(2.5,-1.6) 4(2.5,1.6)
LED-TH_SLD1388DRA1GD
  round 1.524 hole 0.914: 1(-8.89,-12) 2(-6.35,-12) 3(-3.81,-12) 4(-1.27,-12) 5(1.27,-12) 6(3.81,-12) 7(6.35,-12) 8(8.89,-12) 9(8.89,12) 10(6.35,12) 11(3.81,12) 12(1.27,12) 13(-1.27,12) 14(-3.81,12) 15(-6.35,12) 16(-8.89,12)
R1206-NSK
  rrect 1.219x1.65 smd: 1(-1.35,0) 2(1.35,0)
RES-ADJ-TH_RV09
  oval 1.8x1.5 hole 1.1x0.8: 1(-2.5,-3.5) 2(0,-3.5) 3(2.5,-3.5)
  oval 2.5x3.5 hole 1.5x2.5: 4(4.8,3.5) 5(-4.8,3.5)
SMA_L4.2-W2.6-LS5.3-RD
  rect 2.2x1.7 smd: 1(-2.566,0) 2(2.566,0)
SMA_L4.3-W2.6-LS5.2-RD
  rect 2x2 smd: 1(-2.2,0) 2(2.2,0)
SOIC-24_L15.4-W7.5-P1.27-LS10.3-TL
  oval 2x0.6 smd: 1(-4.7,6.985) 2(-4.7,5.715) 3(-4.7,4.445) 4(-4.7,3.175) 5(-4.7,1.905) 6(-4.7,0.635) 7(-4.7,-0.635) 8(-4.7,-1.905) 9(-4.7,-3.175) 10(-4.7,-4.445) 11(-4.7,-5.715) 12(-4.7,-6.985) 13(4.7,-6.985) 14(4.7,-5.715) 15(4.7,-4.445) 16(4.7,-3.175) 17(4.7,-1.905) 18(4.7,-0.635) 19(4.7,0.635) 20(4.7,1.905) 21(4.7,3.175) 22(4.7,4.445) 23(4.7,5.715) 24(4.7,6.985)
SOT-23-5_L3.0-W1.7-P0.95-LS2.8-BR
  rect 1.1x0.6 smd: 1(1.3,-0.95) 2(1.3,0) 3(1.3,0.95) 4(-1.3,0.95) 5(-1.3,-0.95)
SOT-23-6_L2.9-W1.6-P0.95-LS2.8-BL
  rect 0.532x1.072 smd: 1(-0.95,-1.149) 2(0,-1.149) 3(0.95,-1.149) 4(0.95,1.149) 5(0,1.149) 6(-0.95,1.149)
SW-SMD_L6.0-W3.5-LS8.2
  rect 2.42x1.28 smd: 1(-3.296,0) 2(3.296,0)

## Nets
As in the schematic.

Pads without a net: U5 16 17 18 19 25 40; U6 24; U9 1 6 11; U10 2

## Via types
v1: diameter 0.61, hole 0.305, Top Layer to Bottom Layer, 76 vias
v2: diameter 1.143, hole 0.635, Top Layer to Bottom Layer, 9 vias
v3: diameter 0.762, hole 0.508, Top Layer to Bottom Layer, 1 via
v4: diameter 1.016, hole 0.635, Top Layer to Bottom Layer, 1 via
v5: diameter 1.143, hole 0.762, Top Layer to Bottom Layer, 1 via

## Routing (per net, layer and track width the routed paths; a pad name or vN(x,y) marks a point on that pad's centre or on a via; arc(x,y) is an arc through that point)
3V3: length 200.5
  Top Layer w0.127: v1(61.42,3.2) 61.42,3.2 R7.2 ; R9.1 14.1,68.86 13.15,67.91 U8.2 ; v1(76,13.61) 86.11,13.61 87.04,14.55 R18.2 R16.2 R15.2 ; C2.2 17.8,41.07 18.8,42.06 21.97,42.06 22.99,41.04 R2.1
  Top Layer w0.381: U14.6 11.94,27.77 11.94,25.84 C22.1 11.94,25.77 v1(11.94,24.79) ; 15.88,40.79 v1(15.88,42.82)
  Top Layer w0.508: 12.78,37.7 v3(12.78,33.8)
  Top Layer w0.762: H2.4 H2.3 H2.2 H2.1 12.78,37.7 15.88,40.79 C2.2
  Bottom Layer w0.127: v1(76,13.61) 75.99,13.6
  Bottom Layer w0.381: 12.78,24.79 v1(11.94,24.79) ; 12.78,24.79 v3(12.78,33.8) ; 12.78,24.79 12.78,21.66 18.16,16.28 36.07,16.28 37.85,18.06 37.85,9.93 39.53,8.25 U7.2 49.31,8.25 50.42,7.13 50.42,4.34 51.56,3.2 v1(61.42,3.2) 73.66,3.2 75.99,5.52 R6.1 ; v1(15.88,42.82) 15.88,53.49 13.15,56.21 U8.2
+5V: length 162.3
  Top Layer w0.203: 26.82,37.09 26.82,37.6 v1(26.8,37.61) ; 24.22,38.99 v1(24.22,39.52)
  Top Layer w0.381: v1(66.55,47.41) 69.57,44.39 R5.2 79.48,44.39 79.86,44.77 ; U6.19 79.73,44.9 79.86,44.77 ; 79.86,44.77 79.86,44.52 C13.2 ; v1(20.19,22.76) 18.03,22.76 17.14,21.87 D2.2
  Top Layer w0.762: 26.84,35.45 26.9,35.39 C5.2 ; 37.12,61.36 v5(37.12,42.44)
  Top Layer w1.016: U5.24 U5.23 U5.22 ; 37.12,61.36 41.11,61.36
  Bottom Layer w0.203: v1(24.22,39.52) 26.29,39.52 26.8,39.01 v1(26.8,37.61)
  Bottom Layer w0.381: v1(20.19,22.76) 20.19,33.74 20.25,33.8 ; v1(66.55,47.41) 66.55,66.95 64.9,68.6 45.85,68.6 44.83,67.59 44.83,64.79 43.94,63.9 41.11,63.9
  Bottom Layer w0.762: H1.4 H1.3 H1.2 H1.1 13.98,34.94 15.11,33.8 22.99,33.8 24.64,35.46 v4(27.81,35.46) 33.78,35.46 37.12,38.8 v5(37.12,42.44)
+5V_BUCK: length 24.4
  Top Layer w0.127: R1.2 12.95,63.52 13.97,64.54 31.88,64.54 32.72,63.69 32.72,61.36
GND: length 11.8
  Top Layer w0.381: 37.21,3.97 U13.3 ; 37.21,3.97 v2(37.21,2.06) ; 37.21,3.97 44.6,3.97 U7.3
  vias: v1(7.2,29.74) v1(7.2,27.07) v1(7.24,24.53) v1(8.51,29.74) v1(8.49,24.53) v1(16.36,27.78) v1(16.36,26.52) v1(17.03,60.21) v1(17.52,34.92) v1(17.92,27.78) v1(17.92,26.52) v1(18.66,34.92) v1(19.09,61.16) v1(19.09,60.21) v1(19.09,59.26) v1(19.8,39.27) v1(19.8,34.92) v1(20.93,39.27) v1(20.93,34.92) v1(21.84,63.52) v1(21.84,58.95) v1(22.07,39.27) v1(22.07,34.92) v1(22.99,63.52) v1(22.99,58.95) v1(23.32,38.05) v1(24,63.52) v1(24,58.95) v1(24.26,42.57) v1(25.02,63.52) v1(25.02,58.95) v1(25.52,38.95) v1(25.52,38.04) v1(25.52,37.11) v1(26.16,63.52) v1(26.16,58.95) v1(30.73,41.04) v1(31.75,31.14) v1(75.24,57.59) v1(76.51,60.51) v1(76.51,57.56) v1(76.63,54.92) v1(79.94,56.57) v1(81.59,60.63) v1(82.1,57.33) v1(83.37,57.33) v2(8.22,2.06) v2(17.88,2.06) v2(24.84,46.53) v2(24.84,43.7) v2(27.55,2.06) v2(64.26,22.76) v2(64.57,31.87) v2(64.57,27.09)
VIN: length 11.9
  Top Layer w0.762: C9.1 29.21,54.25 28.45,55.01 C6.2
ADC1_1: length 23.6
  Top Layer w0.127: R6.2 78.49,15.39 77.98,14.88 64.77,14.88 64.13,15.52 64.13,17.55 63.52,18.16 C16.2 62.21,18.18 U5.1
AUDIO_SHUT: length 24.6
  Top Layer w0.127: U14.1 28.13,25.23 30.61,27.71 35.43,27.71 36.19,28.47 36.19,30.12 36.96,30.89 U5.35
DIG0: length 22.3
  Top Layer w0.203: U6.2 v1(84.81,57.33)
  Bottom Layer w0.203: LED5.13 80.58,41.58 81.34,42.35 84.39,42.35 84.81,42.77 v1(84.81,57.33)
DIG1: length 14.3
  Top Layer w0.203: U6.11 73.38,61.56 73.97,62.16 82.61,62.16 83.12,62.67 LED5.3
DIG2: length 5.6
  Top Layer w0.203: U6.6 v1(79.73,60.63)
  Bottom Layer w0.203: v1(79.73,60.63) 79.73,63.53 LED5.4
DIG3: length 23.1
  Top Layer w0.203: v1(76.89,42.35) 73.44,42.35 72.96,41.87 LED5.10 ; U6.7 v1(78.46,57.08)
  Bottom Layer w0.203: v1(78.46,57.08) 78.46,47.85 77.53,46.92 77.53,42.98 v1(76.89,42.35)
DIG4: length 18.3
  Top Layer w0.203: U6.3 83.5,59.17 v1(83.5,60.63)
  Bottom Layer w0.203: LED5.6 75.5,66.09 76.13,66.73 83.5,66.73 84.39,65.84 84.39,62.54 83.5,61.65 v1(83.5,60.63)
DIG5: length 19.1
  Top Layer w0.203: v1(75.24,55.55) 74.65,56.15 U6.10
  Bottom Layer w0.203: LED5.11 75.5,41.75 75.24,42 v1(75.24,55.55)
DIG6: length 22.8
  Top Layer w0.203: U6.5 81,57.16 81.72,56.44 85.28,56.44 v1(85.66,56.06)
  Bottom Layer w0.203: LED5.15 v1(85.66,56.06)
DIG7: length 29
  Top Layer w0.203: U6.8 77.19,55.77 77.78,55.17 v1(87.44,55.17)
  Bottom Layer w0.203: v1(87.44,55.17) 87.44,41.14 LED5.16
I2S_BCK: length 27.8
  Top Layer w0.127: U14.3 21.27,27.77 21.59,28.09 21.59,30.63 22.35,31.39 28.83,31.39 29.72,32.28 29.72,35.08 30.61,35.96 41.11,35.96
I2S_DIN: length 31.2
  Top Layer w0.127: 38.86,41.04 38.35,40.54 38.35,37.49 37.72,36.85 30.1,36.85 29.08,35.84 29.08,33.04 28.32,32.28 20.45,32.28 19.84,31.67 U14.4 ; 38.86,41.05 U5.31
I2S_LCK: length 27.1
  Top Layer w0.127: U5.34 37.97,33.43 37.34,34.06 30.99,34.06 30.35,33.42 30.35,31.9 29.08,30.63 22.99,30.63 22.23,29.87 22.23,27.2 21.53,26.5 U14.2
IMU_INT1: length 22.5
  Top Layer w0.127: 24.13,21.36 28.19,21.36 29.21,22.38 29.21,24.66 29.72,25.17 36.32,25.17 36.96,25.8 36.96,27.96 37.34,28.35 U5.36
IMU_SCL: length 7.6
  Top Layer w0.127: U5.38 38.36,23.27 36.45,21.36 34.29,21.36
IMU_SDA: length 7.6
  Top Layer w0.127: 34.29,23.9 37.08,23.9 38.99,25.8 41.11,25.8
KEY1: length 43.1
  Top Layer w0.127: C10.2 v1(90.81,29.49) R15.1 89.74,26.22 SW1.1
  Bottom Layer w0.127: v1(90.81,29.49) 90.81,34.31 89.16,35.96 U5.8
KEY2: length 44.3
  Top Layer w0.127: SW2.1 89.74,19.59 R16.1 91.95,22.88 C11.2
  Bottom Layer w0.127: U5.6 87.76,30.88 89.28,29.36 89.28,23.64 90.07,22.86 v1(90.83,22.86)
KEY3: length 48.5
  Top Layer w0.127: C14.2 91.93,16.28 R18.1 89.74,12.97 SW3.1
  Bottom Layer w0.127: v1(90.88,16.26) 88.92,16.26 87.76,17.42 87.76,27.2 86.62,28.34 U5.5
LCD_BL: length 23.2
  Bottom Layer w0.127: U8.8 35.75,66.38 36.96,65.17 36.96,55.14 38.36,53.74 40.48,53.74
LCD_CS: length 27.8
  Bottom Layer w0.127: 40.48,51.2 37.47,51.2 36.19,52.47 36.19,64.16 35.05,65.3 26.93,65.3 U8.7
LCD_DC: length 32.6
  Bottom Layer w0.127: U8.6 24.77,64.92 34.29,64.92 35.43,63.78 35.43,49.93 36.71,48.66 40.48,48.66
LCD_MOSI: length 39.9
  Bottom Layer w0.127: 40.48,46.12 36.45,46.12 34.8,47.77 34.8,63.52 33.86,64.46 20.15,64.46 U8.4
LCD_SCK: length 44.3
  Bottom Layer w0.127: U8.3 18.03,64.04 33.39,64.04 34.04,63.4 34.04,46.25 36.71,43.58 40.48,43.58
LED1: length 18
  Top Layer w0.127: U5.12 63.25,46.12 64.38,44.99 64.38,34.83 65.02,34.19 R11.2
LED2: length 20
  Top Layer w0.127: U5.11 62.36,43.58 63.37,42.57 63.37,30.25 63.9,29.72 65.94,29.72 65.96,29.74
LED3: length 22.3
  Top Layer w0.127: R13.2 63.37,25.04 62.74,25.68 62.74,40.41 62.11,41.04 U5.10
LED4: length 24.4
  Top Layer w0.127: U5.9 61.34,38.5 61.98,37.87 61.98,21.11 62.61,20.47 R14.2
MAT_CLK: length 13.7
  Top Layer w0.127: U5.13 62.51,48.66 63.58,49.73 U6.13
MAT_LOAD: length 16.5
  Top Layer w0.127: U5.15 68.45,53.74 72.11,57.4 U6.12
MAT_SDA: length 33.9
  Top Layer w0.127: U5.14 67.31,51.2 70.36,54.25 v1(86.49,54.25) ; U6.1 v1(86.08,57.3)
  Bottom Layer w0.127: v1(86.49,54.25) 86.49,56.89 v1(86.08,57.3)
MIC_DAT: length 26.7
  Top Layer w0.127: U5.4 47.75,25.8 46.34,24.39 U7.1
MIC_SCK: length 16.7
  Top Layer w0.127: U5.3 55.12,23.26 53.96,22.11 U7.6
MIC_WS: length 16.4
  Top Layer w0.127: U5.2 57.53,20.72 56.64,19.83 56.64,9.04 55.85,8.25 U7.5
RGB: length 16.8
  Top Layer w0.127: U5.39 38.23,20.73 37.17,19.67 U13.4
SEGA: length 22.5
  Top Layer w0.203: U6.14 v1(73.38,47.43)
  Bottom Layer w0.203: LED5.14 83.12,39.17 81.85,37.9 74.74,37.9 74.21,38.43 74.21,41.86 73.38,42.68 v1(73.38,47.43)
SEGB: length 18.9
  Top Layer w0.203: LED5.8 71.62,63.17 v1(74.23,63.17) ; v1(75.88,51.49) 75.88,49.77 U6.16
  Bottom Layer w0.203: v1(75.88,51.49) 75.88,62.28 74.99,63.17 v1(74.23,63.17)
SEGC: length 14.9
  Top Layer w0.203: U6.20 v1(81,51.36)
  Bottom Layer w0.203: v1(81,51.36) 81,43.15 80.45,42.6 78.67,42.6 78.04,41.96 LED5.12
SEGD: length 22.1
  Top Layer w0.203: U6.23 84.81,47.89 85.28,47.43 87.69,47.43 88.2,47.93 LED5.1
SEGDP: length 29.5
  Top Layer w0.203: U6.22 83.54,52.97 82.86,53.65 71.05,53.65 70.42,53.01 v1(70.42,51.87)
  Bottom Layer w0.203: LED5.9 v1(70.42,51.87)
SEGE: length 25.6
  Top Layer w0.203: U6.21 82.27,52.21 81.77,52.71 71.61,52.71 v1(71.56,52.76)
  Bottom Layer w0.203: LED5.7 72.96,62.67 71.56,61.27 v1(71.56,52.76)
SEGF: length 25
  Top Layer w0.203: LED5.2 85.66,62.04 85.01,61.4 v1(75.24,61.4) ; U6.15 74.61,49.77 v1(74.61,51.49)
  Bottom Layer w0.203: v1(75.24,61.4) 74.61,60.76 v1(74.61,51.49)
SEGG: length 15
  Top Layer w0.203: U6.17 v1(77.19,51.36)
  Bottom Layer w0.203: LED5.5 77.19,63.53 v1(77.19,51.36)
SPK+: length 17.5
  Top Layer w0.381: U14.8 14.47,22.5 13.21,21.23 C23.2 5.21,21.26 CN1.2
SPK-: length 17
  Top Layer w0.381: U14.5 14.47,31.4 13.46,32.41 C24.2 5.18,27.48 CN1.1
$1N3653: length 2.1
  Top Layer w0.127: U2.6 20.21,63.19 C1.2
$1N3654: length 2.4
  Top Layer w0.127: C1.1 17.3,62.23 17.92,61.61 U2.1
$1N3655: length 5
  Top Layer w0.203: U2.3 15.25,59.26 R4.2 R1.1
$1N9647: length 4.2
  Top Layer w0.127: U1.5 26.85,39.02 R2.2 R3.2
$2N2035: length 7.4
  Top Layer w0.203: U12.4 28.78,7.21 29.23,6.75 29.23,4.44 29.69,3.99 32.15,3.99 U13.2
$2N2040: length 7.4
  Top Layer w0.203: U10.4 9.45,7.21 9.91,6.75 9.91,4.44 10.36,3.99 12.82,3.99 U11.2
$2N2043: length 7.4
  Top Layer w0.203: 18.23,7.21 19.51,7.21 19.96,6.75 19.96,4.44 20.42,3.99 22.88,3.99 22.9,4.01
$2N2181: length 52.3
  Top Layer w0.381: 12.89,13.21 3.91,13.21 3.2,12.49 C17.2 3.2,7.22 U10.1 ; 12.89,13.21 12.89,10.48 C18.2 12.85,7.21 U11.1 ; 12.89,13.21 D2.1 22.51,13.21 ; U13.1 32.16,7.22 C20.2 32.16,12.82 31.77,13.21 22.51,13.21 ; 22.51,13.21 U12.1
$2N3036: length 2.4
  Top Layer w0.127: 68.71,31.86 68.66,31.91 R11.1
$2N3041: length 2.5
  Top Layer w0.127: 68.66,29.74 68.71,29.69 68.71,27.27
$2N3046: length 2.4
  Top Layer w0.127: 68.71,22.69 68.66,22.75 R13.1
$2N3051: length 2.4
  Top Layer w0.127: R14.1 68.66,18.17 68.71,18.11
$2N4680: length 3.4
  Top Layer w0.127: U6.18 78.46,48.38 77.17,47.09 76.96,47.09
$2N12609: length 2.5
  Top Layer w0.127: U8.5 20.78,66.39 R9.2
$2N13495: length 3.5
  Top Layer w0.127: 34.29,28.98 34.29,32.2 R10.2
$2N13842: length 7.9
  Top Layer w0.381: U7.4 58.69,5.71 R7.1 R8.2

## Copper pours and planes (outline as drawn; the poured copper is in the pictures)
3V3 on Top Layer: 16.89,41.93 18.67,41.93 18.67,35.84 16.89,35.84
+5V on Top Layer: 26.21,37.49 28.19,37.49 28.19,34.44 26.21,34.44
+5V_BUCK on Top Layer: 24.89,62.89 34.04,62.89 34.04,59.7 24.89,59.7
GND on Top Layer: -49.4,83.59 146.43,83.59 146.43,-14.2 -49.4,-14.2
GND on Bottom Layer: -16.51,96.54 119.38,96.54 119.38,-41.63 -16.51,-41.63
VIN on Top Layer: 12.83,53.49 30.35,53.49 30.35,48.79 12.83,48.79
VIN on Top Layer: 19.57,60.55 21.46,60.55 21.46,54 19.57,54
$1N3653 on Top Layer: 19.58,62.63 22.99,62.63 22.99,59.84 19.58,59.84
$1N9651 on Top Layer: 20.72,38.5 24.84,38.5 24.84,35.71 20.72,35.71

Small or netless copper shapes (teardrops, artwork), in the pictures only: 220 on Top Layer, 78 on Bottom Layer

## Text on the board
Top Silkscreen Layer: GND | 3V3 | SCK | MOSI | RST | DC | CS | BL | SCK: IO40 / MOSI: IO39 / DC: IO38 / CS: IO47 / BL: IO48 | EN: IO16 / LCK: IO17 / BCK: IO18 / DAT: IO21 | Address / :0x6A / :0x6B | INT1: IO15 / SDA: IO41 / SCL: IO42 | Empty for / left channel | LCK (WS): IO2 / BCK: IO3 / DAT: IO4 | ADC: IO1 | LED: / IO8 - IO11 | LOAD: IO14, SDA: IO13, CLK: IO12 | TFT LCD | 6V-16V | I²S Audio | IMU | DMIC | Potentiometer | KEY: IO5 - IO7 | LED Matrix HT7219 | RGB WS2812b (IO45) | 5V | Power
